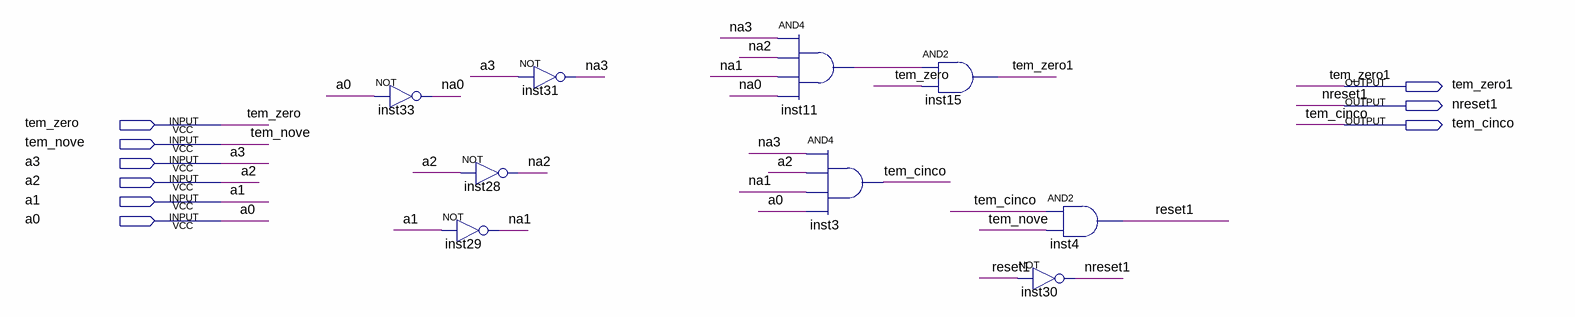
[diagram p0: schematic sheet]
// Quartus schematic tem_cinco.bdf as structural Verilog: 9 symbols, 9 pins
module tem_cinco (
  input  tem_zero,
  input  tem_nove,
  input  a3,
  input  a2,
  input  a1,
  input  a0,
  output tem_zero1,
  output nreset1,
  output tem_cinco
);

  wire inst11_out, na0, na1, na2, na3, reset1;

  not inst33 (na0, a0);
  not inst28 (na2, a2);
  not inst29 (na1, a1);
  not inst31 (na3, a3);
  and inst11 (inst11_out, na3, na2, na1, na0);
  and inst3 (tem_cinco, na3, a2, na1, a0);
  and inst15 (tem_zero1, inst11_out, tem_zero);
  not inst30 (nreset1, reset1);
  and inst4 (reset1, tem_cinco, tem_nove);
endmodule
